# EAGLE design Reinhard (EAGLE 6.6.0)
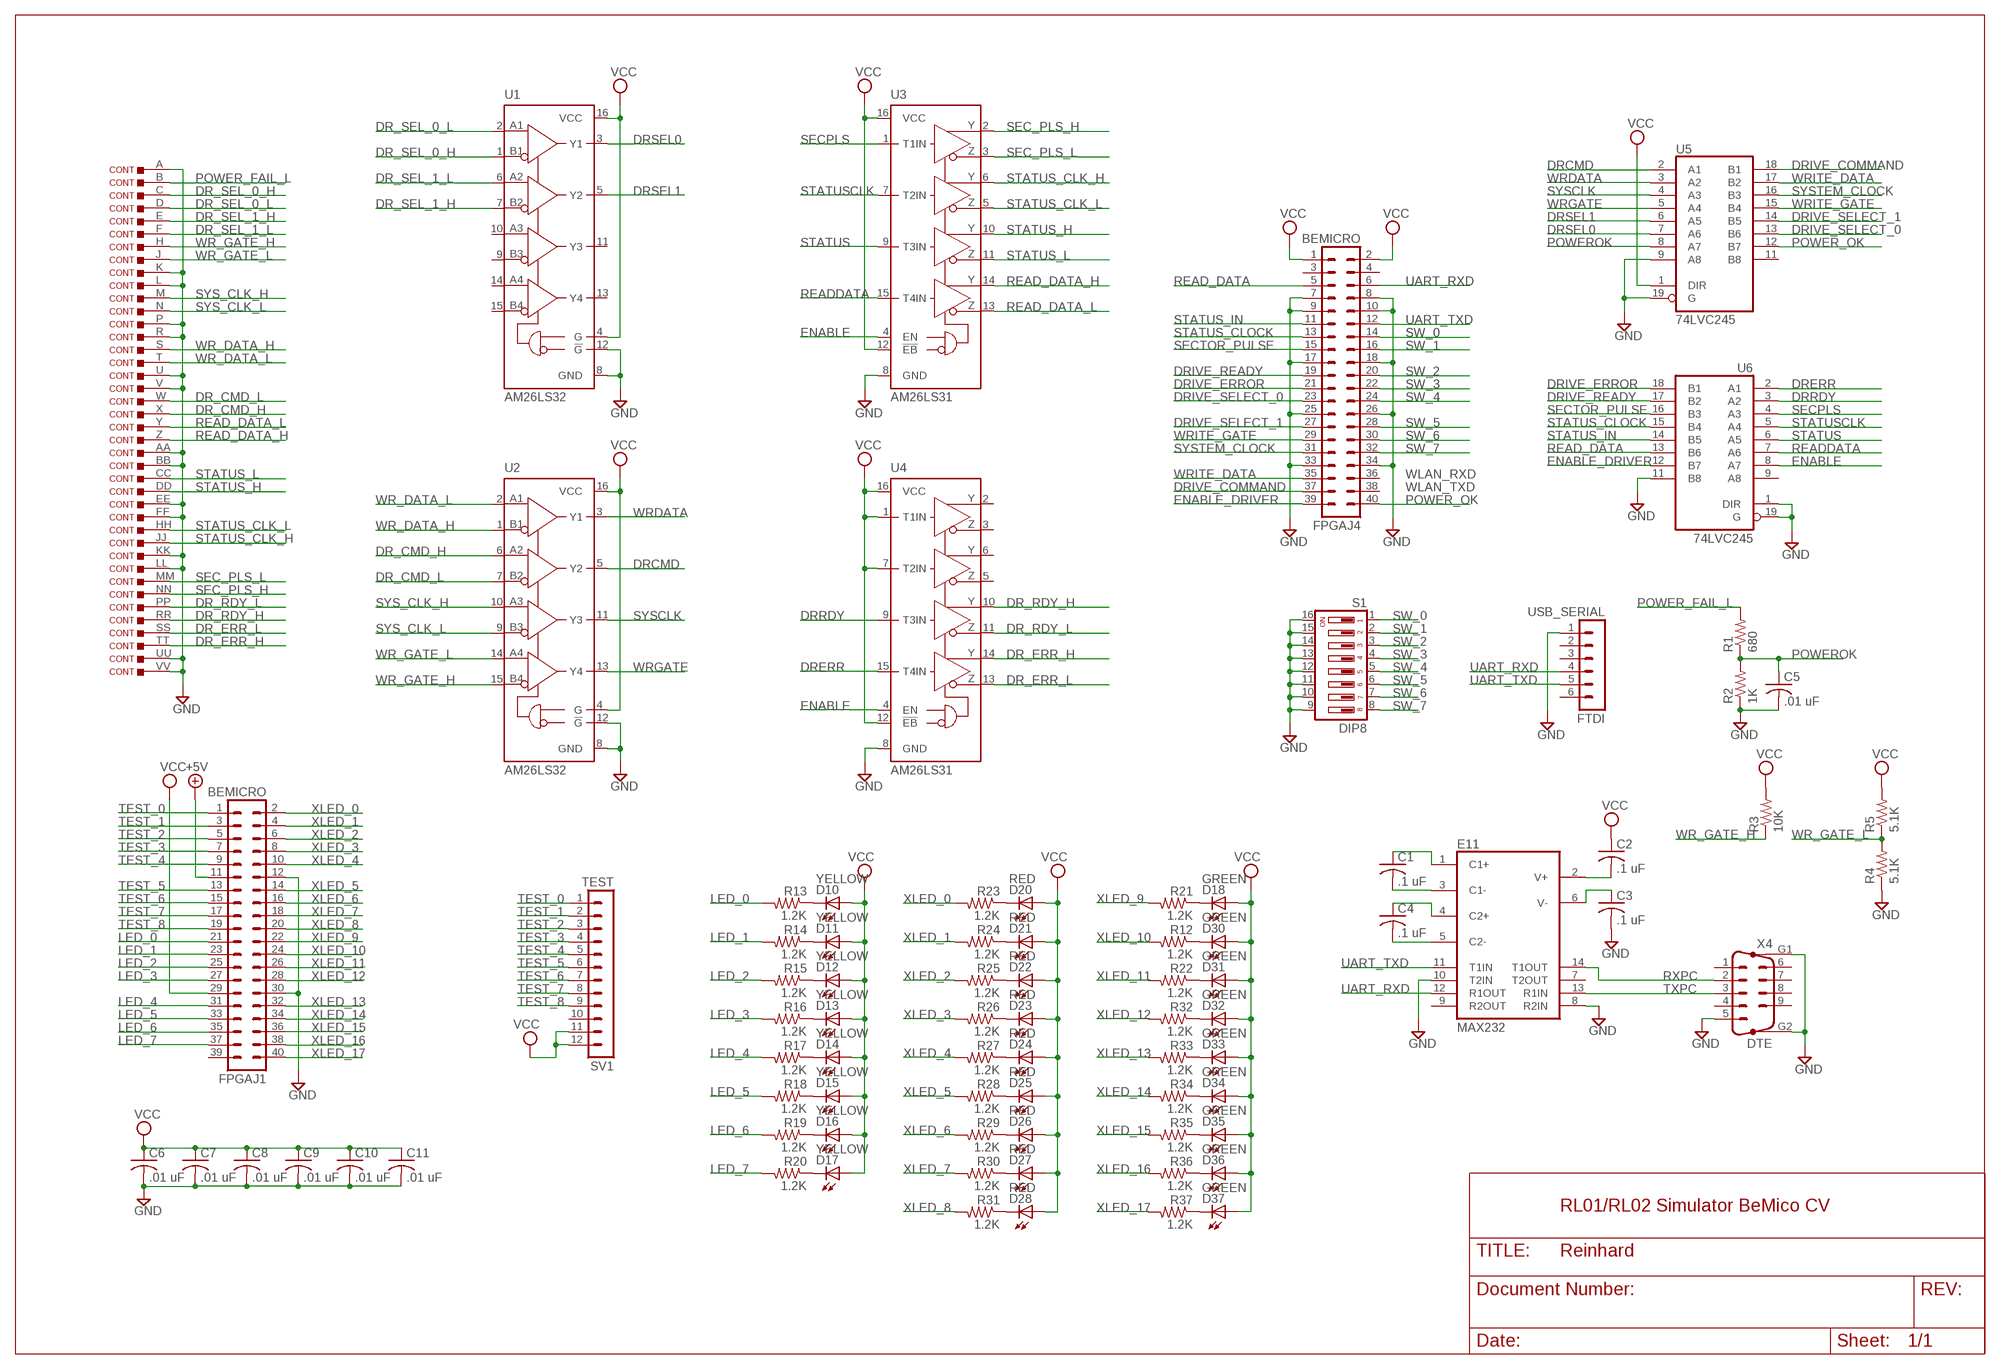
[diagram p0: schematic, sheet 1]

## Parts
C1  .1 uF  C-US050-025X075  [C050-025X075]
C2  .1 uF  C-US050-025X075  [C050-025X075]
C3  .1 uF  C-US050-025X075  [C050-025X075]
C4  .1 uF  C-US050-025X075  [C050-025X075]
C5  .01 uF  C-US050-025X075  [C050-025X075]
C6  .01 uF  C-US050-025X075  [C050-025X075]
C7  .01 uF  C-US050-025X075  [C050-025X075]
C8  .01 uF  C-US050-025X075  [C050-025X075]
C9  .01 uF  C-US050-025X075  [C050-025X075]
C10  .01 uF  C-US050-025X075  [C050-025X075]
C11  .01 uF  C-US050-025X075  [C050-025X075]
CONT  DEC40PINSV  [DEC40PINV]
D10  YELLOW  LED3MM  [LED3MM]
D11  YELLOW  LED3MM  [LED3MM]
D12  YELLOW  LED3MM  [LED3MM]
D13  YELLOW  LED3MM  [LED3MM]
D14  YELLOW  LED3MM  [LED3MM]
D15  YELLOW  LED3MM  [LED3MM]
D16  YELLOW  LED3MM  [LED3MM]
D17  YELLOW  LED3MM  [LED3MM]
D18  GREEN  LED3MM  [LED3MM]
D20  RED  LED3MM  [LED3MM]
D21  RED  LED3MM  [LED3MM]
D22  RED  LED3MM  [LED3MM]
D23  RED  LED3MM  [LED3MM]
D24  RED  LED3MM  [LED3MM]
D25  RED  LED3MM  [LED3MM]
D26  RED  LED3MM  [LED3MM]
D27  RED  LED3MM  [LED3MM]
D28  RED  LED3MM  [LED3MM]
D30  GREEN  LED3MM  [LED3MM]
D31  GREEN  LED3MM  [LED3MM]
D32  GREEN  LED3MM  [LED3MM]
D33  GREEN  LED3MM  [LED3MM]
D34  GREEN  LED3MM  [LED3MM]
D35  GREEN  LED3MM  [LED3MM]
D36  GREEN  LED3MM  [LED3MM]
D37  GREEN  LED3MM  [LED3MM]
E11  MAX232  [DIL16]
FPGAJ1  BEMICRO  MA20-2  [MA20-2]
FPGAJ4  BEMICRO  MA20-2  [MA20-2]
FTDI  USB_SERIAL  MA06-1  [MA06-1]
R1  680  R-US_0207/10  [0207/10]
R2  1K  R-US_0207/10  [0207/10]
R3  10K  R-US_0207/10  [0207/10]
R4  5.1K  R-US_0207/10  [0207/10]
R5  5.1K  R-US_0207/10  [0207/10]
R12  1.2K  R-US_0207/10  [0207/10]
R13  1.2K  R-US_0207/10  [0207/10]
R14  1.2K  R-US_0207/10  [0207/10]
R15  1.2K  R-US_0207/10  [0207/10]
R16  1.2K  R-US_0207/10  [0207/10]
R17  1.2K  R-US_0207/10  [0207/10]
R18  1.2K  R-US_0207/10  [0207/10]
R19  1.2K  R-US_0207/10  [0207/10]
R20  1.2K  R-US_0207/10  [0207/10]
R21  1.2K  R-US_0207/10  [0207/10]
R22  1.2K  R-US_0207/10  [0207/10]
R23  1.2K  R-US_0207/10  [0207/10]
R24  1.2K  R-US_0207/10  [0207/10]
R25  1.2K  R-US_0207/10  [0207/10]
R26  1.2K  R-US_0207/10  [0207/10]
R27  1.2K  R-US_0207/10  [0207/10]
R28  1.2K  R-US_0207/10  [0207/10]
R29  1.2K  R-US_0207/10  [0207/10]
R30  1.2K  R-US_0207/10  [0207/10]
R31  1.2K  R-US_0207/10  [0207/10]
R32  1.2K  R-US_0207/10  [0207/10]
R33  1.2K  R-US_0207/10  [0207/10]
R34  1.2K  R-US_0207/10  [0207/10]
R35  1.2K  R-US_0207/10  [0207/10]
R36  1.2K  R-US_0207/10  [0207/10]
R37  1.2K  R-US_0207/10  [0207/10]
S1  DIP8  DIP08YL  [DIP08YL]
SV1  TEST  MA12-1  [MA12-1]
U1  AM26LS32  MAX3095CPE  [DIL16]
U2  AM26LS32  MAX3095CPE  [DIL16]
U3  AM26LS31  MAX304  [DIL16]
U4  AM26LS31  MAX304  [DIL16]
U5  74LVC245  74LS245N  [DIL20]
U6  74LVC245  74LS245N  [DIL20]
X4  DTE  M09HP  [M09HP]

## Nets
+5V: FPGAJ1.11
DR_CMD_H: CONT.X U2.6(A2)
DR_CMD_L: CONT.W U2.7(B2)
DR_ERR_H: CONT.TT U4.14(Y4)
DR_ERR_L: CONT.SS U4.13(Z4)
DR_RDY_H: CONT.RR U4.10(Y3)
DR_RDY_L: CONT.PP U4.11(Z3)
DR_SEL_0_H: CONT.C U1.1(B1)
DR_SEL_0_L: CONT.D U1.2(A1)
DR_SEL_1_H: CONT.E U1.7(B2)
DR_SEL_1_L: CONT.F U1.6(A2)
DRCMD: U2.5(Y2) U5.2(A1)
DRERR: U4.15(T4IN) U6.2(A1)
DRIVE_COMMAND: FPGAJ4.37 U5.18(B1)
DRIVE_ERROR: FPGAJ4.21 U6.18(B1)
DRIVE_READY: FPGAJ4.19 U6.17(B2)
DRIVE_SELECT_0: FPGAJ4.23 U5.13(B6)
DRIVE_SELECT_1: FPGAJ4.27 U5.14(B5)
DRRDY: U4.9(T3IN) U6.3(A2)
DRSEL0: U1.3(Y1) U5.7(A6)
DRSEL1: U1.5(Y2) U5.6(A5)
ENABLE: U3.4(EN) U4.4(EN) U6.8(A7)
ENABLE_DRIVER: FPGAJ4.39 U6.12(B7)
GND: C3.2 C5.2 C6.2 C7.2 C8.2 C9.2 C10.2 C11.2 CONT.A CONT.AA CONT.BB CONT.EE CONT.FF CONT.K CONT.KK CONT.L CONT.LL CONT.P CONT.R CONT.U CONT.UU CONT.V CONT.VV E11.8(R2IN) E11.10(T2IN) FPGAJ1.12 FPGAJ1.30 FPGAJ4.7 FPGAJ4.8 FPGAJ4.9 FPGAJ4.10 FPGAJ4.17 FPGAJ4.18 FPGAJ4.25 FPGAJ4.26 FPGAJ4.33 FPGAJ4.34 FTDI.1 R2.1 R4.1 S1.9 S1.10 S1.11 S1.12 S1.13 S1.14 S1.15 S1.16 U1.8(GND) U1.12(!G) U2.8(GND) U2.12(!G) U3.8(GND) U4.8(GND) U5.9(A8) U5.19(G) U6.1(DIR) U6.11(B8) U6.19(G) X4.5 X4.G1 X4.G2
LED_0: FPGAJ1.21 R13.2
LED_1: FPGAJ1.23 R14.2
LED_2: FPGAJ1.25 R15.2
LED_3: FPGAJ1.27 R16.2
LED_4: FPGAJ1.31 R17.2
LED_5: FPGAJ1.33 R18.2
LED_6: FPGAJ1.35 R19.2
LED_7: FPGAJ1.37 R20.2
N$1: C1.2 E11.3(C1-)
N$2: C1.1 E11.1(C1+)
N$3: C4.1 E11.4(C2+)
N$4: C4.2 E11.5(C2-)
N$5: C3.1 E11.6(V-)
N$6: C2.2 E11.2(V+)
N$16: D30.K(C) R12.1
N$17: D31.K(C) R22.1
N$18: D32.K(C) R32.1
N$19: D33.K(C) R33.1
N$20: D34.K(C) R34.1
N$21: D35.K(C) R35.1
N$22: D36.K(C) R36.1
N$23: D37.K(C) R37.1
N$27: D10.K(C) R13.1
N$28: D11.K(C) R14.1
N$29: D12.K(C) R15.1
N$30: D13.K(C) R16.1
N$31: D14.K(C) R17.1
N$32: D15.K(C) R18.1
N$33: D16.K(C) R19.1
N$34: D17.K(C) R20.1
N$35: D18.K(C) R21.1
N$47: D20.K(C) R23.1
N$48: D21.K(C) R24.1
N$49: D22.K(C) R25.1
N$50: D23.K(C) R26.1
N$51: D24.K(C) R27.1
N$52: D25.K(C) R28.1
N$53: D26.K(C) R29.1
N$54: D27.K(C) R30.1
N$55: D28.K(C) R31.1
POWER_FAIL_L: CONT.B R1.2
POWER_OK: FPGAJ4.40 U5.12(B7)
POWEROK: C5.1 R1.1 R2.2 U5.8(A7)
READ_DATA: FPGAJ4.5 U6.13(B6)
READ_DATA_H: CONT.Z U3.14(Y4)
READ_DATA_L: CONT.Y U3.13(Z4)
READDATA: U3.15(T4IN) U6.7(A6)
RXPC: E11.14(T1OUT) X4.2
SEC_PLS_H: CONT.NN U3.2(Y1)
SEC_PLS_L: CONT.MM U3.3(Z1)
SECPLS: U3.1(T1IN) U6.4(A3)
SECTOR_PULSE: FPGAJ4.15 U6.16(B3)
STATUS: U3.9(T3IN) U6.6(A5)
STATUS_CLK_H: CONT.JJ U3.6(Y2)
STATUS_CLK_L: CONT.HH U3.5(Z2)
STATUS_CLOCK: FPGAJ4.13 U6.15(B4)
STATUS_H: CONT.DD U3.10(Y3)
STATUS_IN: FPGAJ4.11 U6.14(B5)
STATUS_L: CONT.CC U3.11(Z3)
STATUSCLK: U3.7(T2IN) U6.5(A4)
SW_0: FPGAJ4.14 S1.1
SW_1: FPGAJ4.16 S1.2
SW_2: FPGAJ4.20 S1.3
SW_3: FPGAJ4.22 S1.4
SW_4: FPGAJ4.24 S1.5
SW_5: FPGAJ4.28 S1.6
SW_6: FPGAJ4.30 S1.7
SW_7: FPGAJ4.32 S1.8
SYS_CLK_H: CONT.M U2.10(A3)
SYS_CLK_L: CONT.N U2.9(B3)
SYSCLK: U2.11(Y3) U5.4(A3)
SYSTEM_CLOCK: FPGAJ4.31 U5.16(B3)
TEST_0: FPGAJ1.1 SV1.1
TEST_1: FPGAJ1.3 SV1.2
TEST_2: FPGAJ1.5 SV1.3
TEST_3: FPGAJ1.7 SV1.4
TEST_4: FPGAJ1.9 SV1.5
TEST_5: FPGAJ1.13 SV1.6
TEST_6: FPGAJ1.15 SV1.7
TEST_7: FPGAJ1.17 SV1.8
TEST_8: FPGAJ1.19 SV1.9
TXPC: E11.13(R1IN) X4.3
UART_RXD: E11.12(R1OUT) FPGAJ4.6 FTDI.4
UART_TXD: E11.11(T1IN) FPGAJ4.12 FTDI.5
VCC: C2.1 C6.1 C7.1 C8.1 C9.1 C10.1 C11.1 D10.A D11.A D12.A D13.A D14.A D15.A D16.A D17.A D18.A D20.A D21.A D22.A D23.A D24.A D25.A D26.A D27.A D28.A D30.A D31.A D32.A D33.A D34.A D35.A D36.A D37.A FPGAJ1.29 FPGAJ4.1 FPGAJ4.2 R3.2 R5.2 SV1.11 SV1.12 U1.4(G) U1.16(VCC) U2.4(G) U2.16(VCC) U3.12(!EB) U3.16(VCC) U4.1(T1IN) U4.7(T2IN) U4.12(!EB) U4.16(VCC) U5.1(DIR)
WR_DATA_H: CONT.S U2.1(B1)
WR_DATA_L: CONT.T U2.2(A1)
WR_GATE_H: CONT.H R3.1 U2.15(B4)
WR_GATE_L: CONT.J R4.2 R5.1 U2.14(A4)
WRDATA: U2.3(Y1) U5.3(A2)
WRGATE: U2.13(Y4) U5.5(A4)
WRITE_DATA: FPGAJ4.35 U5.17(B2)
WRITE_GATE: FPGAJ4.29 U5.15(B4)
XLED_0: FPGAJ1.2 R23.2
XLED_1: FPGAJ1.4 R24.2
XLED_2: FPGAJ1.6 R25.2
XLED_3: FPGAJ1.8 R26.2
XLED_4: FPGAJ1.10 R27.2
XLED_5: FPGAJ1.14 R28.2
XLED_6: FPGAJ1.16 R29.2
XLED_7: FPGAJ1.18 R30.2
XLED_8: FPGAJ1.20 R31.2
XLED_9: FPGAJ1.22 R21.2
XLED_10: FPGAJ1.24 R12.2
XLED_11: FPGAJ1.26 R22.2
XLED_12: FPGAJ1.28 R32.2
XLED_13: FPGAJ1.32 R33.2
XLED_14: FPGAJ1.34 R34.2
XLED_15: FPGAJ1.36 R35.2
XLED_16: FPGAJ1.38 R36.2
XLED_17: FPGAJ1.40 R37.2
Unconnected: E11.7(T2OUT) E11.9(R2OUT) FPGAJ1.39 FPGAJ4.3 FPGAJ4.4 FPGAJ4.36 FPGAJ4.38 FTDI.2 FTDI.3 FTDI.6 SV1.10 U1.9(B3) U1.10(A3) U1.11(Y3) U1.13(Y4) U1.14(A4) U1.15(B4) U4.2(Y1) U4.3(Z1) U4.5(Z2) U4.6(Y2) U5.11(B8) U6.9(A8) X4.1 X4.4 X4.6 X4.7 X4.8 X4.9

## Notes on the sheet
- WLAN_RXD
- WLAN_TXD
- RL01/RL02 Simulator BeMico CV

## Power pins joined to a net without a drawn wire
GND: E11.15(GND) U5.10(GND) U6.10(GND)
VCC: E11.16(VCC) U5.20(VCC) U6.20(VCC)

## Library data of the parts
C1-C11 = rcl:C-US: CAPACITOR, American symbol
CONT = dec-con:DEC40PINS: 40 pin ribbon connector for BC08, BC11 cables.
D10-D18 D20-D28 D30-D37 = led:LED: LED OSRAM: - CHIPLED LG R971, LG N971, LY N971, LG Q971, LY Q971, LO R971, LY R971 LH N974, LH R974 LS Q976, LO Q976, LY Q976 LO Q996 - Hyper CHIPLED LW Q18S LB Q993, LB Q99A, LB R99A - SideLED LS A670, LO A670, LY A670, LG A670, LP A670 LB A673, LV A673, LT A673, LW A673 LH A674 LY A675 LS A676, LA A676, LO A676, LY A676, LW A676 LS A679, LY A679, LG A679 - Hyper Micro SIDELED® LS Y876, LA Y876, LO Y876, LY Y876 LT Y87S - SmartLED LW L88C, LW L88S LB L89C, LB L89S, LG L890 LS L89K, LO L89K, LY L89K LS L896, LA L896, LO L896, LY L896 - TOPLED LS T670, LO T670, LY T670, LG T670, LP T670 LSG T670, LSP T670, LSY T670, LOP T670, LYG T670 LG T671, LOG T671, LSG T671 LB T673, LV T673, LT T673, LW T673 LH T674 LS T676, LA T676, LO T676, LY T676, LB T676, LH T676, LSB T676, LW T676 LB T67C, LV T67C, LT T67C, LS T67K, LO T67K, LY T67K, LW E67C LS E67B, LA E67B, LO E67B, LY E67B, LB E67C, LV E67C, LT E67C LW T67C LS T679, LY T679, LG T679 LS T770, LO T770, LY T770, LG T770, LP T770 LB T773, LV T773, LT T773, LW T773 LH T774 LS E675, LA E675, LY E675, LS T675 LS T776, LA T776, LO T776, LY T776, LB T776 LHGB T686 LT T68C, LB T68C - Hyper Mini TOPLED® LB M676 - Mini TOPLED Santana® LG M470 LS M47K, LO M47K, LY M47K Source: http://www.osram.convergy.de LUXEON: - LUMILED® LXK2-PW12-R00, LXK2-PW12-S00, LXK2-PW14-U00, LXK2-PW14-V00 LXK2-PM12-R00, LXK2-PM12-S00, LXK2-PM14-U00 LXK2-PE12-Q00, LXK2-PE12-R00, LXK2-PE12-S00, LXK2-PE14-T00, LXK2-PE14-U00 LXK2-PB12-K00, LXK2-PB12-L00, LXK2-PB12-M00, LXK2-PB14-N00, LXK2-PB14-P00, LXK2-PB14-Q00 LXK2-PR12-L00, LXK2-PR12-M00, LXK2-PR14-Q00, LXK2-PR14-R00 LXK2-PD12-Q00, LXK2-PD12-R00, LXK2-PD12-S00 LXK2-PH12-R00, LXK2-PH12-S00 LXK2-PL12-P00, LXK2-PL12-Q00, LXK2-PL12-R00 Source: www.luxeon.com KINGBRIGHT: KA-3528ASYC Source: www.kingbright.com
E11 = maxim:MAX232: RS232 TRANSCEIVER; MF: MAXIM; MPN: MAX232ACPE+; OC_FARNELL: 9723773; OC_NEWARK: 68K4544
FPGAJ1 FPGAJ4 = con-lstb:MA20-2: PIN HEADER; OC_FARNELL: unknown; OC_NEWARK: unknown
FTDI = con-lstb:MA06-1: PIN HEADER; OC_FARNELL: unknown; OC_NEWARK: unknown
R1-R5 R12-R37 = rcl:R-US_: RESISTOR, American symbol
S1 = switch-dil:DIP08YL: DIL/CODE SWITCH; OC_FARNELL: unknown; OC_NEWARK: unknown
SV1 = con-lstb:MA12-1: PIN HEADER; OC_FARNELL: unknown; OC_NEWARK: unknown
U1 U2 = maxim:MAX309*: ±15kV ESD-Protected, 10Mbps, 3V/5V, Quad RS-422/RS-485 Receivers Source: http://pdfserv.maxim-ic.com/en/ds/MAX3095-MAX3096.pdf; MF: MAXIM; MPN: MAX3095CPE+; OC_FARNELL: 9723919; OC_NEWARK: 67K4750
U3 U4 = maxim:MAX304*: ±10kV ESD-Protected, Quad 5V RS-485/422 Transmitters Source: MAX3040-MAX3045.pdf
U5 U6 = 74xx-us:74*245: Octal BUS TRANSCEIVER, 3-state
X4 = con-subd:M09HP: SUB-D; OC_FARNELL: unknown; OC_NEWARK: unknown

## Board
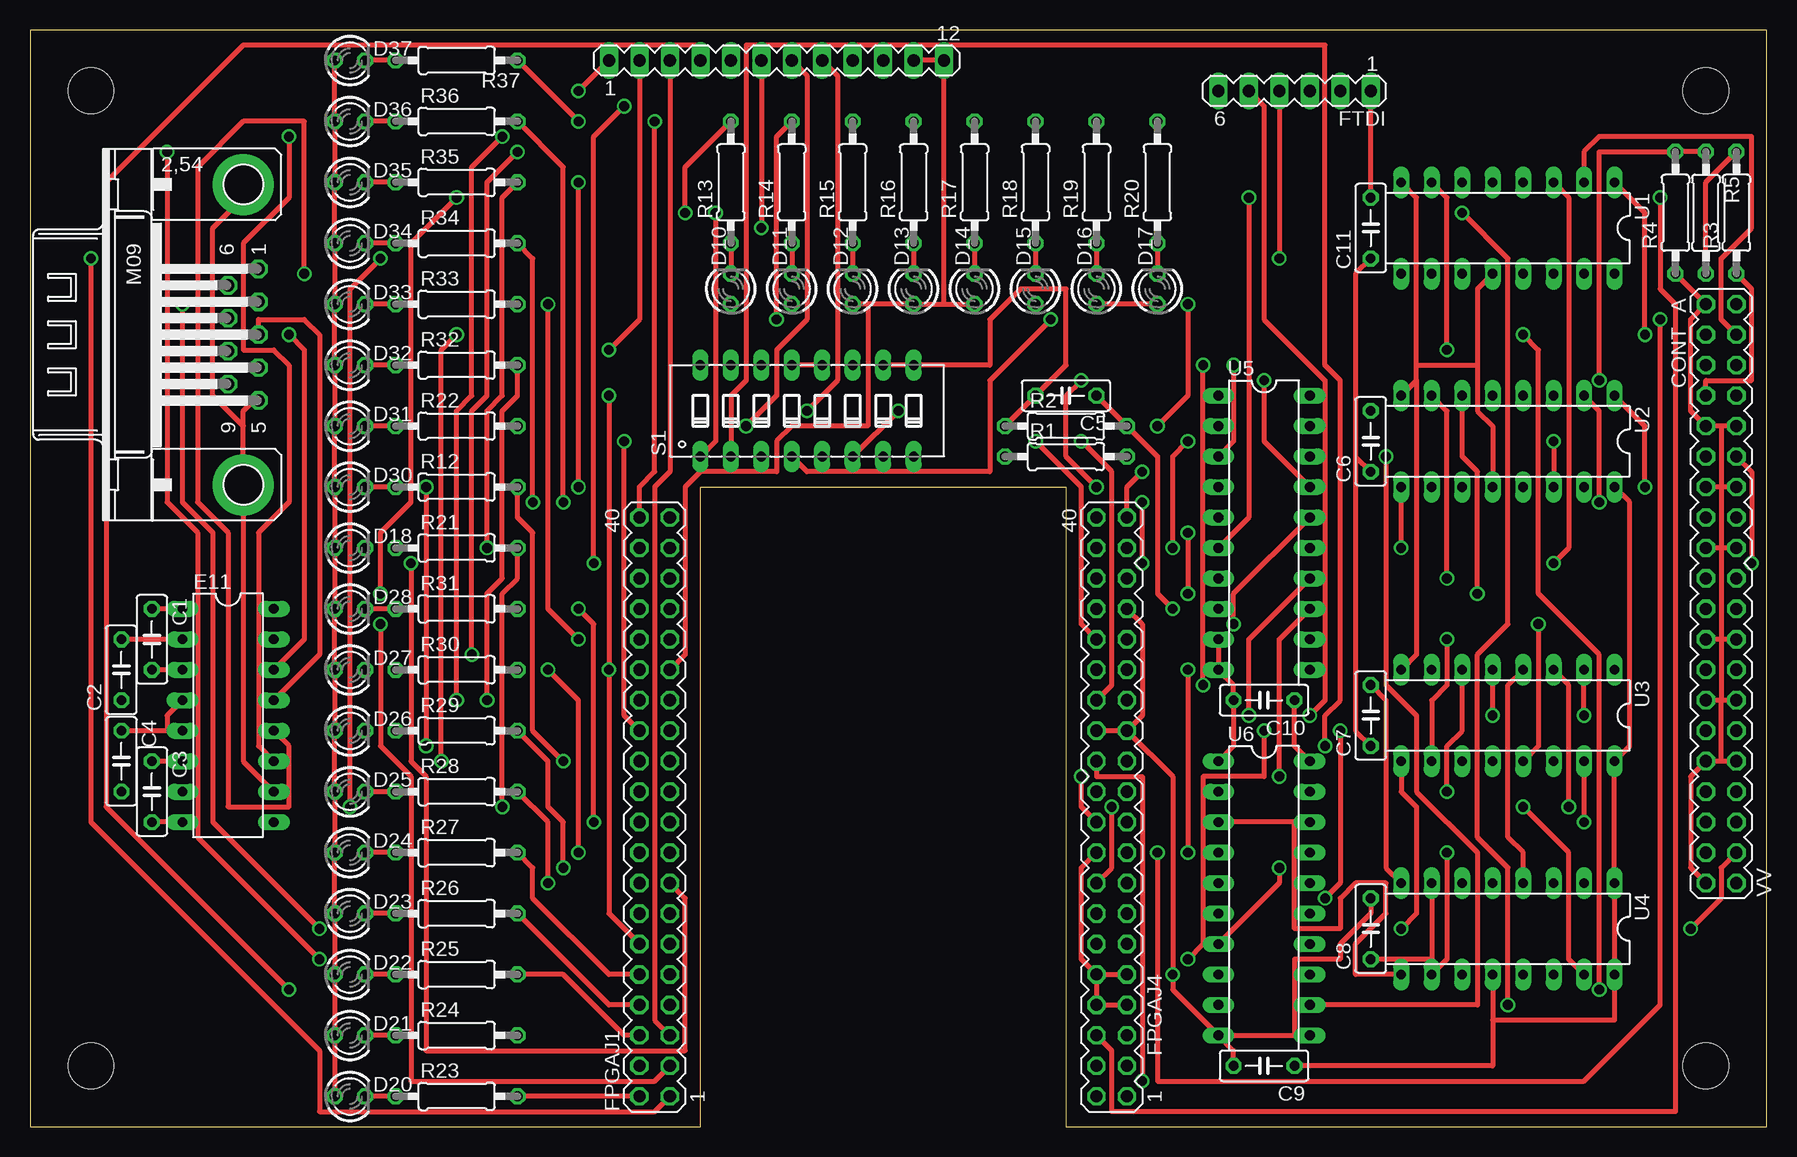
[diagram p1: board, top side]
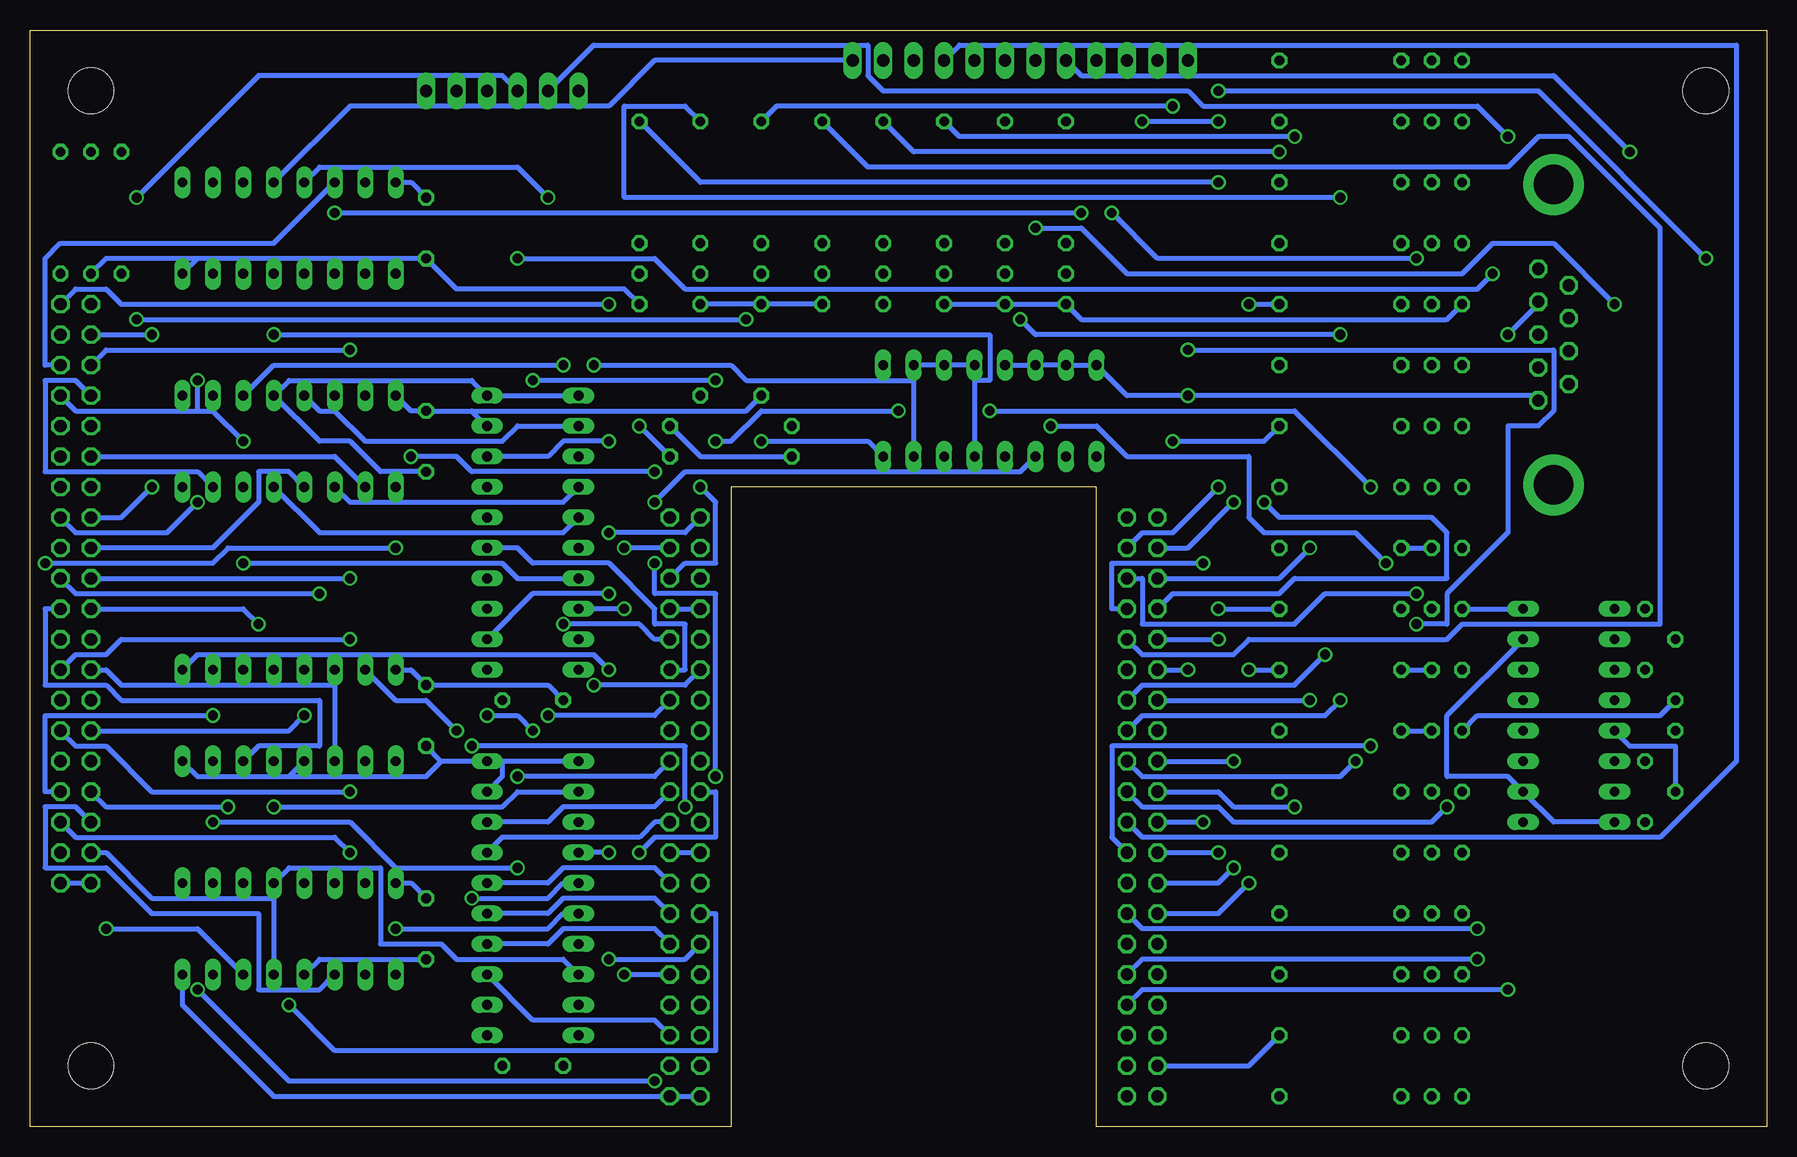
[diagram p2: board, bottom side, seen from below]

Size 144.78 x 91.44 mm. Coordinates in mm from the lower left corner, seen from the top.
Outline: 0,0 55.88,0 55.88,53.34 86.36,53.34 86.36,0 144.78,0 144.78,91.44 0,91.44 0,0
Copper layers (1+16): Top 0.035mm / dielectric 1.5mm / Bottom 0.035mm
Design rules "16mils": minimum track width 16mil, minimum drill 32mil, track to track 15mil, track to pad 10mil, pad to pad 10mil, via to via 10mil, smd to smd 10mil, copper to edge 13mil, drill to drill 10mil, minimum pad ring 10mil, minimum via ring 8mil, stop-mask expansion 0mil, vias tented up to drill 0mil, thermal gap 10mil
Holes 3.81 mm at 5.08,86.36 139.7,86.36 5.08,5.08 139.7,5.08

### Footprints (pad centres in the part's own frame; a part is rotated, then mirrored left to right if it is on the bottom)
C050-025X075 = drill 0.813 octagon: 1 -2.54,0; 2 2.54,0
DEC40PINV = drill 1.016 octagon: A -24.13,-1.27; AA 3.81,-1.27; B -24.13,1.27; BB 3.81,1.27; C -21.59,-1.27; CC 6.35,-1.27; D -21.59,1.27; DD 6.35,1.27; E -19.05,-1.27; EE 8.89,-1.27; F -19.05,1.27; FF 8.89,1.27; H -16.51,-1.27; HH 11.43,-1.27; J -16.51,1.27; JJ 11.43,1.27; K -13.97,-1.27; KK 13.97,-1.27; L -13.97,1.27; LL 13.97,1.27; M -11.43,-1.27; MM 16.51,-1.27; N -11.43,1.27; NN 16.51,1.27; P -8.89,-1.27; PP 19.05,-1.27; R -8.89,1.27; RR 19.05,1.27; S -6.35,-1.27; SS 21.59,-1.27; T -6.35,1.27; TT 21.59,1.27; U -3.81,-1.27; UU 24.13,-1.27; V -3.81,1.27; VV 24.13,1.27; W -1.27,-1.27; X -1.27,1.27; Y 1.27,-1.27; Z 1.27,1.27
LED3MM = drill 0.813 octagon: A -1.27,0; K 1.27,0
DIL16 = drill 0.813 long: 1 -8.89,-3.81; 2 -6.35,-3.81; 3 -3.81,-3.81; 4 -1.27,-3.81; 5 1.27,-3.81; 6 3.81,-3.81; 7 6.35,-3.81; 8 8.89,-3.81; 9 8.89,3.81; 10 6.35,3.81; 11 3.81,3.81; 12 1.27,3.81; 13 -1.27,3.81; 14 -3.81,3.81; 15 -6.35,3.81; 16 -8.89,3.81
MA20-2 = drill 1.016 octagon: 1 -24.13,-1.27; 2 -24.13,1.27; 3 -21.59,-1.27; 4 -21.59,1.27; 5 -19.05,-1.27; 6 -19.05,1.27; 7 -16.51,-1.27; 8 -16.51,1.27; 9 -13.97,-1.27; 10 -13.97,1.27; 11 -11.43,-1.27; 12 -11.43,1.27; 13 -8.89,-1.27; 14 -8.89,1.27; 15 -6.35,-1.27; 16 -6.35,1.27; 17 -3.81,-1.27; 18 -3.81,1.27; 19 -1.27,-1.27; 20 -1.27,1.27; 21 1.27,-1.27; 22 1.27,1.27; 23 3.81,-1.27; 24 3.81,1.27; 25 6.35,-1.27; 26 6.35,1.27; 27 8.89,-1.27; 28 8.89,1.27; 29 11.43,-1.27; 30 11.43,1.27; 31 13.97,-1.27; 32 13.97,1.27; 33 16.51,-1.27; 34 16.51,1.27; 35 19.05,-1.27; 36 19.05,1.27; 37 21.59,-1.27; 38 21.59,1.27; 39 24.13,-1.27; 40 24.13,1.27
MA06-1 = drill 1.016 long: 1 -6.35,0; 2 -3.81,0; 3 -1.27,0; 4 1.27,0; 5 3.81,0; 6 6.35,0
0207/10 = drill 0.813 octagon: 1 -5.08,0; 2 5.08,0
DIP08YL = drill 0.813 long: 1 -8.89,-3.81; 2 -6.35,-3.81; 3 -3.81,-3.81; 4 -1.27,-3.81; 5 1.27,-3.81; 6 3.81,-3.81; 7 6.35,-3.81; 8 8.89,-3.81; 9 8.89,3.81; 10 6.35,3.81; 11 3.81,3.81; 12 1.27,3.81; 13 -1.27,3.81; 14 -3.81,3.81; 15 -6.35,3.81; 16 -8.89,3.81
MA12-1 = drill 1.016 long: 1 -13.97,0; 2 -11.43,0; 3 -8.89,0; 4 -6.35,0; 5 -3.81,0; 6 -1.27,0; 7 1.27,0; 8 3.81,0; 9 6.35,0; 10 8.89,0; 11 11.43,0; 12 13.97,0
DIL20 = drill 0.813 long: 1 -11.43,-3.81; 2 -8.89,-3.81; 3 -6.35,-3.81; 4 -3.81,-3.81; 5 -1.27,-3.81; 6 1.27,-3.81; 7 3.81,-3.81; 8 6.35,-3.81; 9 8.89,-3.81; 10 11.43,-3.81; 11 11.43,3.81; 12 8.89,3.81; 13 6.35,3.81; 14 3.81,3.81; 15 1.27,3.81; 16 -1.27,3.81; 17 -3.81,3.81; 18 -6.35,3.81; 19 -8.89,3.81; 20 -11.43,3.81
M09HP = drill 1.016 octagon: 1 -5.486,1.27; 2 -2.743,1.27; 3 0,1.27; 4 2.743,1.27; 5 5.486,1.27; 6 -4.115,-1.27; 7 -1.372,-1.27; 8 1.372,-1.27; 9 4.115,-1.27 | drill 3.302 pad 5.08: G1 -12.522,0; G2 12.522,0

### Placement (x,y rotation side)
C1  10.16,40.64 270 top
C2  7.62,38.1 90 top
C3  10.16,27.94 270 top
C4  7.62,30.48 270 top
C5  86.36,60.96 180 top
C6  111.76,57.15 90 top
C7  111.76,34.29 90 top
C8  111.76,16.51 90 top
C9  102.87,5.08 180 top
C10  102.87,35.56 180 top
C11  111.76,74.93 90 top
CONT  140.97,44.45 270 top
D10  58.42,69.85 90 top
D11  63.5,69.85 90 top
D12  68.58,69.85 90 top
D13  73.66,69.85 90 top
D14  78.74,69.85 90 top
D15  83.82,69.85 90 top
D16  88.9,69.85 90 top
D17  93.98,69.85 90 top
D18  26.67,48.26 0 top
D20  26.67,2.54 0 top
D21  26.67,7.62 0 top
D22  26.67,12.7 0 top
D23  26.67,17.78 0 top
D24  26.67,22.86 0 top
D25  26.67,27.94 0 top
D26  26.67,33.02 0 top
D27  26.67,38.1 0 top
D28  26.67,43.18 0 top
D30  26.67,53.34 0 top
D31  26.67,58.42 0 top
D32  26.67,63.5 0 top
D33  26.67,68.58 0 top
D34  26.67,73.66 0 top
D35  26.67,78.74 0 top
D36  26.67,83.82 0 top
D37  26.67,88.9 0 top
E11  16.51,34.29 270 top
FPGAJ1  52.07,26.67 90 top
FPGAJ4  90.17,26.67 90 top
FTDI  105.41,86.36 180 top
R1  86.36,55.88 0 top
R2  86.36,58.42 0 top
R3  142.24,76.2 90 top
R4  137.16,76.2 90 top
R5  139.7,76.2 270 top
R12  35.56,53.34 0 top
R13  58.42,78.74 90 top
R14  63.5,78.74 90 top
R15  68.58,78.74 90 top
R16  73.66,78.74 90 top
R17  78.74,78.74 90 top
R18  83.82,78.74 90 top
R19  88.9,78.74 90 top
R20  93.98,78.74 90 top
R21  35.56,48.26 0 top
R22  35.56,58.42 0 top
R23  35.56,2.54 0 top
R24  35.56,7.62 0 top
R25  35.56,12.7 0 top
R26  35.56,17.78 0 top
R27  35.56,22.86 0 top
R28  35.56,27.94 0 top
R29  35.56,33.02 0 top
R30  35.56,38.1 0 top
R31  35.56,43.18 0 top
R32  35.56,63.5 0 top
R33  35.56,68.58 0 top
R34  35.56,73.66 0 top
R35  35.56,78.74 0 top
R36  35.56,83.82 0 top
R37  35.56,88.9 0 top
S1  64.77,59.69 0 top
SV1  62.23,88.9 0 top
U1  123.19,74.93 180 top
U2  123.19,57.15 180 top
U3  123.19,34.29 180 top
U4  123.19,16.51 180 top
U5  102.87,49.53 270 top
U6  102.87,19.05 270 top
X4  17.78,66.04 270 top

### Tracks (layer width: path | path; a pad name or v marks a point on that pad's centre or on a via)
DR_CMD_H  (via drill 0.81)
  Top 0.406: U2.6 119.38,55.88 120.65,54.61 v120.65,44.45
  Bottom 0.406: v120.65,44.45 140.97,44.45 CONT.X
DR_CMD_L  (via drill 0.81)
  Top 0.406: U2.7 118.11,59.69 v118.11,45.72
  Bottom 0.406: CONT.W v118.11,45.72
DR_ERR_H  (via drill 0.81)
  Top 0.406: v138.43,16.51 140.97,19.05 140.97,21.59 CONT.TT
  Bottom 0.406: U4.14 130.81,16.51 v138.43,16.51
DR_ERR_L
  Bottom 0.406: U4.13 124.46,19.05 134.62,19.05 138.43,22.86 CONT.SS
DR_RDY_H  (via drill 0.81)
  Top 0.406: U4.10 118.11,13.97 v118.11,22.86
  Bottom 0.406: v118.11,22.86 119.38,24.13 140.97,24.13 CONT.RR
DR_RDY_L
  Bottom 0.406: U4.11 120.65,11.43 125.73,11.43 125.73,17.78 134.62,17.78 138.43,21.59 143.51,21.59 143.51,26.67 140.97,26.67 CONT.PP
DR_SEL_0_H  (via drill 0.81)
  Top 0.406: U1.1 134.62,76.2 v134.62,66.04
  Bottom 0.406: CONT.C v134.62,66.04
DR_SEL_0_L
  Top 0.406: U1.2 129.54,81.28 130.81,82.55 143.51,82.55 143.51,74.93 140.97,72.39 140.97,67.31 CONT.D
DR_SEL_1_H  (via drill 0.81)
  Top 0.406: U1.7 118.11,77.47 v118.11,64.77
  Bottom 0.406: v118.11,64.77 138.43,64.77 CONT.E
DR_SEL_1_L
  Bottom 0.406: U1.6 124.46,73.66 142.24,73.66 143.51,72.39 143.51,63.5 CONT.F
DRCMD
  Bottom 0.406: U5.2 104.14,58.42 105.41,57.15 116.84,57.15 119.38,59.69 120.65,59.69 U2.5
DRERR  (via drill 0.81)
  Top 0.406: v124.46,26.67 128.27,22.86 128.27,13.97 U4.15
  Bottom 0.406: U6.2 104.14,27.94 105.41,26.67 v124.46,26.67
DRIVE_COMMAND  (via drill 0.81)
  Top 0.406: v96.52,57.15 95.25,55.88 v95.25,48.26
  Bottom 0.406: U5.18 101.6,55.88 100.33,57.15 v96.52,57.15 | FPGAJ4.37 v95.25,48.26
DRIVE_ERROR
  Bottom 0.406: U6.18 101.6,25.4 100.33,26.67 92.71,26.67 FPGAJ4.21
DRIVE_READY
  Bottom 0.406: U6.17 105.41,24.13 93.98,24.13 92.71,25.4 FPGAJ4.19
DRIVE_SELECT_0  (via drill 0.81)
  Top 0.406: U5.13 104.14,40.64 v104.14,29.21
  Bottom 0.406: v104.14,29.21 92.71,29.21 FPGAJ4.23
DRIVE_SELECT_1  (via drill 0.81)
  Top 0.406: U5.14 101.6,40.64 v101.6,34.29
  Bottom 0.406: v101.6,34.29 92.71,34.29 FPGAJ4.27
DRRDY
  Top 0.406: U6.3 105.41,25.4 105.41,16.51 109.22,16.51 109.22,19.05 110.49,20.32 113.03,20.32 113.03,17.78 110.49,15.24 110.49,12.7 U4.9
DRSEL0  (via drill 0.81)
  Top 0.406: v127,46.99 128.27,48.26 128.27,77.47 U1.3
  Bottom 0.406: U5.7 104.14,45.72 105.41,46.99 v127,46.99
DRSEL1  (via drill 0.81)
  Top 0.406: U5.6 101.6,50.8 v101.6,77.47
  Bottom 0.406: v101.6,77.47 104.14,80.01 120.65,80.01 U1.5
ENABLE
  Top 0.406: U3.4 123.19,36.83 123.19,24.13 124.46,22.86 U4.4
  Bottom 0.406: U6.8 100.33,13.97 109.22,13.97 110.49,15.24 115.57,15.24 115.57,21.59 123.19,21.59 U4.4
ENABLE_DRIVER  (via drill 0.81)
  Top 0.406: U6.12 120.65,10.16 120.65,22.86 115.57,27.94 115.57,34.29 113.03,36.83 v113.03,55.88 | v92.71,54.61 91.44,53.34 FPGAJ4.39
  Bottom 0.406: v113.03,55.88 109.22,55.88 107.95,54.61 v92.71,54.61
GND  (via drill 0.81)
  Top 0.406: E11.8 C3.2 | FPGAJ1.12 48.26,17.78 v48.26,38.1 v48.26,60.96 | S1.10 S1.9 80.01,63.5 80.01,67.31 82.55,69.85 86.36,69.85 86.36,63.5 C5.2 R2.1 | S1.12 S1.13 | 17.78,58.42 X4.G2 17.78,30.48 E11.10 | 17.78,58.42 17.78,59.69 19.05,60.96 X4.5 | 17.78,58.42 15.24,60.96 15.24,74.93 17.78,77.47 X4.G1 | FPGAJ4.10 FPGAJ4.8 FPGAJ4.7 | FPGAJ4.10 FPGAJ4.9 | FPGAJ4.18 87.63,21.59 87.63,13.97 FPGAJ4.10 | U6.10 100.33,6.35 C9.2 | U6.10 105.41,7.62 | 105.41,7.62 U6.11 | FPGAJ4.25 FPGAJ4.26 | FPGAJ4.25 92.71,34.29 92.71,41.91 FPGAJ4.33 | U6.10 95.25,11.43 v95.25,12.7 95.25,29.21 FPGAJ4.25 | CONT.FF 140.97,35.56 | 140.97,35.56 CONT.EE | CONT.BB 140.97,40.64 | 140.97,40.64 CONT.AA | 140.97,40.64 140.97,35.56 | CONT.LL 140.97,30.48 | 140.97,30.48 CONT.KK 138.43,29.21 138.43,21.59 CONT.UU | 140.97,30.48 140.97,35.56 | CONT.V 140.97,48.26 | 140.97,48.26 CONT.U | CONT.R 140.97,53.34 | 140.97,53.34 CONT.P | 140.97,53.34 140.97,48.26 | CONT.L 140.97,58.42 | 140.97,58.42 CONT.K 138.43,59.69 138.43,67.31 CONT.A R4.1 | 140.97,58.42 140.97,53.34 | 140.97,48.26 140.97,40.64 | U5.9 U5.10 100.33,36.83 C10.2 100.33,31.75 U6.1 | U4.8 113.03,21.59 113.03,35.56 C7.2 | U2.12 121.92,58.42 120.65,59.69 120.65,63.5 | 120.65,63.5 120.65,69.85 U1.12 | C11.2 FTDI.1 | U1.8 115.57,77.47 115.57,63.5 | 115.57,62.23 115.57,63.5 | U2.8 115.57,62.23 | 115.57,63.5 120.65,63.5 | U3.8 115.57,39.37 115.57,62.23 | 105.41,7.62 105.41,13.97 109.22,13.97 109.22,15.24 111.76,17.78 C8.2
  Bottom 0.406: E11.8 17.78,25.4 E11.10 21.59,29.21 26.67,29.21 26.67,34.29 E11.15 | FPGAJ1.30 v48.26,38.1 | S1.12 S1.11 S1.10 | S1.13 S1.14 S1.15 S1.16 53.34,60.96 v48.26,60.96 19.05,60.96 X4.5 | FPGAJ4.17 FPGAJ4.18 | FPGAJ4.33 FPGAJ4.34 | v95.25,12.7 FPGAJ4.9 | CONT.VV CONT.UU | U6.19 105.41,29.21 105.41,30.48 U6.1 | C8.2 113.03,20.32 U4.8 | U3.8 113.03,38.1 C7.2 101.6,36.83 C10.2 | C11.2 113.03,78.74 U1.8 | 107.95,59.69 U5.19 | 107.95,59.69 C6.2 113.03,59.69 U2.8 | C5.2 85.09,59.69 107.95,59.69 | CONT.U 129.54,48.26 125.73,52.07 125.73,54.61 123.19,54.61 U2.12
LED_0  (via drill 0.81)
  Top 0.406: R13.2 54.61,80.01 v54.61,76.2 | v29.21,72.39 26.67,69.85 v26.67,26.67
  Bottom 0.406: v54.61,76.2 50.8,72.39 v29.21,72.39 | v26.67,26.67 27.94,25.4 44.45,25.4 45.72,26.67 52.07,26.67 FPGAJ1.21
LED_1  (via drill 0.81)
  Top 0.406: R14.2 62.23,82.55 v62.23,67.31 | v35.56,66.04 34.29,64.77 v34.29,30.48
  Bottom 0.406: v62.23,67.31 60.96,66.04 v35.56,66.04 | v34.29,30.48 35.56,29.21 52.07,29.21 FPGAJ1.23
LED_2  (via drill 0.81)
  Top 0.406: v39.37,82.55 36.83,80.01 36.83,60.96 35.56,59.69 v35.56,35.56
  Bottom 0.406: R15.2 67.31,82.55 v39.37,82.55 | v35.56,35.56 36.83,34.29 52.07,34.29 FPGAJ1.25
LED_3  (via drill 0.81)
  Top 0.406: v40.64,81.28 38.1,78.74 38.1,60.96 36.83,59.69 v36.83,39.37
  Bottom 0.406: R16.2 71.12,81.28 v40.64,81.28 | v36.83,39.37 39.37,36.83 52.07,36.83 FPGAJ1.27
LED_4
  Bottom 0.406: R17.2 74.93,80.01 21.59,80.01 19.05,82.55 16.51,82.55 8.89,74.93 8.89,41.91 25.4,41.91 26.67,40.64 43.18,40.64 44.45,39.37 52.07,39.37 FPGAJ1.31
LED_5  (via drill 0.81)
  Top 0.406: v49.53,85.09 46.99,82.55 v46.99,46.99
  Bottom 0.406: R18.2 82.55,85.09 v49.53,85.09 | v46.99,46.99 54.61,46.99 54.61,43.18 FPGAJ1.33
LED_6  (via drill 0.81)
  Top 0.406: v35.56,77.47 31.75,73.66 31.75,52.07 29.21,49.53 v29.21,44.45
  Bottom 0.406: R19.2 90.17,85.09 95.25,85.09 95.25,77.47 v35.56,77.47 | v29.21,44.45 36.83,44.45 39.37,41.91 52.07,41.91 52.07,45.72 FPGAJ1.35
LED_7  (via drill 0.81)
  Top 0.406: v45.72,53.34 v45.72,78.74
  Bottom 0.406: R20.2 88.9,78.74 v45.72,78.74 | v45.72,53.34 49.53,49.53 52.07,49.53 FPGAJ1.37
N$1
  Top 0.406: E11.3 C1.2
N$2
  Top 0.406: E11.1 C1.1
N$3
  Top 0.406: C4.1 11.43,33.02 11.43,34.29 E11.4
N$4
  Bottom 0.406: C4.2 7.62,31.75 11.43,31.75 E11.5
N$5
  Top 0.406: E11.6 C3.1
N$6
  Top 0.406: E11.2 C2.2
N$16
  Top 0.406: R12.1 D30.K
N$17
  Top 0.406: R22.1 D31.K
N$18
  Top 0.406: R32.1 D32.K
N$19
  Top 0.406: R33.1 D33.K
N$20
  Top 0.406: R34.1 D34.K
N$21
  Top 0.406: R35.1 D35.K
N$22
  Top 0.406: R36.1 D36.K
N$23
  Top 0.406: R37.1 D37.K
N$27
  Top 0.406: R13.1 D10.K
N$28
  Top 0.406: R14.1 D11.K
N$29
  Top 0.406: R15.1 D12.K
N$30
  Top 0.406: R16.1 D13.K
N$31
  Top 0.406: R17.1 D14.K
N$32
  Top 0.406: R18.1 D15.K
N$33
  Top 0.406: R19.1 D16.K
N$34
  Top 0.406: R20.1 D17.K
N$35
  Bottom 0.406: R21.1 D18.K
N$47
  Top 0.406: R23.1 D20.K
N$48
  Top 0.406: R24.1 D21.K
N$49
  Top 0.406: R25.1 D22.K
N$50
  Top 0.406: R26.1 D23.K
N$51
  Top 0.406: R27.1 D24.K
N$52
  Top 0.406: R28.1 D25.K
N$53
  Bottom 0.406: R29.1 D26.K
N$54
  Bottom 0.406: R30.1 D27.K
N$55
  Top 0.406: R31.1 D28.K
POWER_FAIL_L  (via drill 0.81)
  Top 0.406: v93.98,58.42 96.52,60.96 v96.52,68.58
  Bottom 0.406: v93.98,58.42 R1.2 | v96.52,68.58 137.16,68.58 138.43,69.85 140.97,69.85 CONT.B
POWER_OK  (via drill 0.81)
  Top 0.406: v96.52,49.53 v96.52,44.45
  Bottom 0.406: U5.12 102.87,44.45 v96.52,44.45 | v96.52,49.53 90.17,49.53 FPGAJ4.40
POWEROK  (via drill 0.81)
  Top 0.406: v95.25,43.18 93.98,44.45 93.98,55.88 R2.2 C5.1
  Bottom 0.406: R1.1 88.9,55.88 R2.2 | v95.25,43.18 U5.8
READ_DATA
  Bottom 0.406: U6.13 102.87,8.89 92.71,8.89 FPGAJ4.5
READ_DATA_H
  Bottom 0.406: U3.14 125.73,31.75 120.65,31.75 120.65,35.56 137.16,35.56 138.43,36.83 143.51,36.83 143.51,43.18 CONT.Z
READ_DATA_L  (via drill 0.81)
  Top 0.406: U3.13 125.73,31.75 v125.73,41.91
  Bottom 0.406: v125.73,41.91 127,43.18 CONT.Y
READDATA  (via drill 0.81)
  Top 0.406: U6.7 104.14,20.32 v104.14,21.59 | U3.15 v129.54,25.4
  Bottom 0.406: v104.14,21.59 114.3,21.59 118.11,25.4 v129.54,25.4
RXPC  (via drill 0.81)
  Top 0.406: E11.14 22.86,40.64 22.86,64.77 v21.59,66.04
  Bottom 0.406: v21.59,66.04 19.05,68.58 X4.2
SEC_PLS_H  (via drill 0.81)
  Top 0.406: v129.54,34.29 U3.2
  Bottom 0.406: v129.54,34.29 143.51,34.29 143.51,27.94 CONT.NN
SEC_PLS_L  (via drill 0.81)
  Top 0.406: U3.3 128.27,36.83 v128.27,26.67
  Bottom 0.406: v128.27,26.67 138.43,26.67 CONT.MM
SECPLS  (via drill 0.81)
  Top 0.406: v96.52,38.1 v96.52,22.86
  Bottom 0.406: v96.52,22.86 U6.4 | v96.52,38.1 97.79,39.37 130.81,39.37 U3.1
SECTOR_PULSE
  Bottom 0.406: U6.16 101.6,20.32 100.33,21.59 92.71,21.59 FPGAJ4.15
STATUS  (via drill 0.81)
  Top 0.406: v114.3,16.51 115.57,17.78 115.57,26.67 114.3,27.94 U3.9
  Bottom 0.406: U6.6 100.33,17.78 101.6,16.51 v114.3,16.51
STATUS_CLK_H  (via drill 0.81)
  Top 0.406: U3.6 119.38,33.02 118.11,31.75 v118.11,27.94
  Bottom 0.406: v118.11,27.94 134.62,27.94 138.43,31.75 140.97,31.75 CONT.JJ
STATUS_CLK_L  (via drill 0.81)
  Top 0.406: v121.92,34.29 U3.5
  Bottom 0.406: v121.92,34.29 123.19,33.02 CONT.HH
STATUS_CLOCK
  Bottom 0.406: U6.15 101.6,17.78 100.33,19.05 92.71,19.05 FPGAJ4.13
STATUS_H  (via drill 0.81)
  Top 0.406: U3.10 116.84,35.56 118.11,36.83 v118.11,40.64
  Bottom 0.406: v118.11,40.64 137.16,40.64 138.43,39.37 140.97,39.37 CONT.DD
STATUS_IN
  Bottom 0.406: U6.14 101.6,15.24 100.33,16.51 92.71,16.51 FPGAJ4.11
STATUS_L
  Bottom 0.406: U3.11 119.38,36.83 137.16,36.83 138.43,38.1 CONT.CC
STATUSCLK  (via drill 0.81)
  Top 0.406: v107.95,19.05 109.22,20.32 v109.22,33.02
  Bottom 0.406: U6.5 100.33,20.32 101.6,19.05 v107.95,19.05 | v109.22,33.02 111.76,35.56 114.3,35.56 U3.7
SW_0  (via drill 0.81)
  Top 0.406: S1.1 57.15,57.15 v57.15,76.2 | v119.38,76.2 123.19,72.39 123.19,41.91 120.65,39.37 120.65,24.13 123.19,21.59 v123.19,10.16
  Bottom 0.406: v119.38,76.2 v57.15,76.2 | v123.19,10.16 119.38,6.35 87.63,6.35 87.63,17.78 FPGAJ4.14
SW_1  (via drill 0.81)
  Top 0.406: S1.2 58.42,60.96 59.69,62.23 59.69,90.17 107.95,90.17 107.95,63.5 109.22,62.23 109.22,35.56 107.95,34.29 v107.95,31.75 | v90.17,26.67 90.17,21.59 FPGAJ4.16
  Bottom 0.406: v107.95,31.75 90.17,31.75 v90.17,26.67
SW_2  (via drill 0.81)
  Top 0.406: v92.71,46.99 v92.71,52.07 | v87.63,29.21 87.63,26.67 FPGAJ4.20
  Bottom 0.406: S1.3 62.23,54.61 90.17,54.61 v92.71,52.07 | v92.71,46.99 92.71,44.45 87.63,44.45 v87.63,29.21
SW_3  (via drill 0.81)
  Top 0.406: S1.4 64.77,54.61 80.01,54.61 80.01,62.23 v85.09,67.31 | v135.89,67.31 135.89,10.16 129.54,3.81 93.98,3.81 v93.98,22.86
  Bottom 0.406: v135.89,67.31 v85.09,67.31 | v93.98,22.86 92.71,24.13 87.63,24.13 87.63,27.94 FPGAJ4.22
SW_4  (via drill 0.81)
  Top 0.406: v124.46,66.04 125.73,64.77 125.73,44.45 130.81,39.37 v130.81,11.43 | v92.71,3.81 92.71,29.21 88.9,29.21 FPGAJ4.24
  Bottom 0.406: S1.5 66.04,62.23 64.77,62.23 64.77,66.04 v124.46,66.04 | v130.81,11.43 123.19,3.81 v92.71,3.81
SW_5  (via drill 0.81)
  Top 0.406: v72.39,59.69 S1.6 | v87.63,57.15 90.17,54.61 90.17,36.83 FPGAJ4.28
  Bottom 0.406: v72.39,59.69 83.82,59.69 86.36,57.15 v87.63,57.15
SW_6  (via drill 0.81)
  Top 0.406: v97.79,36.83 v97.79,63.5
  Bottom 0.406: S1.7 71.12,62.23 85.09,62.23 86.36,63.5 v97.79,63.5 | v97.79,36.83 90.17,36.83 FPGAJ4.30
SW_7  (via drill 0.81)
  Top 0.406: v83.82,57.15 87.63,53.34 87.63,41.91 FPGAJ4.32
  Bottom 0.406: S1.8 74.93,57.15 v83.82,57.15
SYS_CLK_H
  Bottom 0.406: U2.10 119.38,55.88 CONT.M
SYS_CLK_L  (via drill 0.81)
  Top 0.406: v114.3,48.26 U2.9 | v143.51,46.99 143.51,54.61 CONT.N
  Bottom 0.406: v114.3,48.26 128.27,48.26 129.54,46.99 v143.51,46.99
SYSCLK
  Bottom 0.406: U5.4 100.33,52.07 118.11,52.07 U2.11
SYSTEM_CLOCK  (via drill 0.81)
  Top 0.406: U5.16 100.33,44.45 v100.33,41.91
  Bottom 0.406: v100.33,41.91 93.98,41.91 92.71,40.64 FPGAJ4.31
TEST_0  (via drill 0.81)
  Top 0.406: FPGAJ1.1 52.07,1.27 24.13,1.27 24.13,6.35 5.08,25.4 v5.08,72.39 | SV1.1 v45.72,86.36
  Bottom 0.406: v5.08,72.39 19.05,86.36 v45.72,86.36
TEST_1  (via drill 0.81)
  Top 0.406: FPGAJ1.3 52.07,3.81 31.75,3.81 31.75,29.21 29.21,31.75 v29.21,41.91 | v48.26,64.77 50.8,67.31 SV1.2
  Bottom 0.406: v29.21,41.91 26.67,41.91 26.67,44.45 21.59,49.53 21.59,58.42 19.05,58.42 17.78,59.69 17.78,64.77 v48.26,64.77
TEST_2
  Top 0.406: FPGAJ1.5 52.07,8.89 52.07,53.34 53.34,54.61 SV1.3
TEST_3  (via drill 0.81)
  Top 0.406: v21.59,11.43 6.35,26.67 6.35,78.74 17.78,90.17 55.88,90.17 SV1.4
  Bottom 0.406: FPGAJ1.7 52.07,11.43 v21.59,11.43
TEST_4  (via drill 0.81)
  Top 0.406: v24.13,13.97 13.97,24.13 13.97,49.53 11.43,52.07 v11.43,81.28
  Bottom 0.406: FPGAJ1.9 52.07,13.97 v24.13,13.97 | v11.43,81.28 17.78,87.63 57.15,87.63 SV1.5
TEST_5  (via drill 0.81)
  Top 0.406: v24.13,16.51 15.24,25.4 15.24,49.53 12.7,52.07 v12.7,68.58 | SV1.6 v60.96,74.93
  Bottom 0.406: FPGAJ1.13 52.07,16.51 v24.13,16.51 | v12.7,68.58 17.78,73.66 22.86,73.66 25.4,71.12 53.34,71.12 57.15,74.93 v60.96,74.93
TEST_6  (via drill 0.81)
  Top 0.406: FPGAJ1.15 54.61,19.05 54.61,6.35 33.02,6.35 33.02,29.21 31.75,30.48 v31.75,46.99 | v59.69,58.42 62.23,60.96 62.23,64.77 64.77,67.31 64.77,87.63 SV1.7
  Bottom 0.406: v31.75,46.99 34.29,49.53 41.91,49.53 43.18,50.8 43.18,55.88 53.34,55.88 55.88,58.42 v59.69,58.42
TEST_7  (via drill 0.81)
  Top 0.406: v33.02,53.34 v33.02,31.75 | v64.77,59.69 67.31,62.23 67.31,87.63 SV1.8
  Bottom 0.406: FPGAJ1.17 54.61,24.13 54.61,31.75 v33.02,31.75 | v33.02,53.34 39.37,59.69 v64.77,59.69
TEST_8
  Bottom 0.406: FPGAJ1.19 52.07,24.13 8.89,24.13 2.54,30.48 2.54,90.17 67.31,90.17 SV1.9
TXPC
  Top 0.406: E11.13 24.13,39.37 24.13,66.04 22.86,67.31 19.05,67.31 X4.3
UART_RXD  (via drill 0.81)
  Top 0.406: E11.12 21.59,31.75 21.59,26.67 16.51,26.67 16.51,49.53 13.97,52.07 13.97,80.01 17.78,83.82 22.86,83.82 v22.86,71.12 | FTDI.4 v104.14,72.39 | FPGAJ4.6 90.17,6.35 90.17,1.27 137.16,1.27 137.16,68.58 135.89,69.85 v135.89,77.47
  Bottom 0.406: v22.86,71.12 24.13,69.85 90.17,69.85 92.71,72.39 v104.14,72.39 | v135.89,77.47 125.73,87.63 105.41,87.63 FTDI.4
UART_TXD  (via drill 0.81)
  Top 0.406: E11.11 19.05,31.75 19.05,49.53 21.59,52.07 21.59,63.5 20.32,64.77 17.78,64.77 17.78,73.66 21.59,77.47 v21.59,82.55 | v96.52,13.97 97.79,15.24 97.79,29.21 102.87,29.21 v102.87,33.02 | v106.68,34.29 107.95,35.56 107.95,62.23 102.87,67.31 102.87,85.09 FTDI.5
  Bottom 0.406: v21.59,82.55 24.13,85.09 46.99,85.09 48.26,86.36 73.66,86.36 74.93,87.63 74.93,90.17 97.79,90.17 FTDI.5 | FPGAJ4.12 90.17,13.97 v96.52,13.97 | v102.87,33.02 104.14,34.29 v106.68,34.29
VCC
  Top 0.406: D37.A D36.A D35.A D34.A D33.A D32.A D31.A D30.A D18.A D28.A D27.A D26.A D25.A D24.A D23.A D22.A D21.A D20.A | C10.1 105.41,31.75 U6.20 | U2.16 133.35,52.07 133.35,31.75 U3.16 U4.1 U4.16 132.08,8.89 121.92,8.89 | C8.1 116.84,13.97 U4.7 | C9.1 121.92,5.08 121.92,8.89 | U4.12 121.92,8.89 | SV1.11 SV1.12 76.2,68.58 | 110.49,55.88 C6.1 | 110.49,55.88 110.49,71.12 C11.1 | D17.A D16.A | 69.85,68.58 D13.A 76.2,68.58 | 69.85,68.58 D12.A | 76.2,68.58 D14.A | FPGAJ1.29 54.61,39.37 54.61,53.34 55.88,54.61 62.23,54.61 62.23,57.15 63.5,58.42 69.85,58.42 69.85,68.58 | C7.1 110.49,33.02 110.49,55.88 | R3.2 139.7,78.74 R5.2
  Bottom 0.406: D28.A E11.16 | C2.1 8.89,34.29 24.13,34.29 D26.A | 110.49,30.48 C7.1 | U6.20 110.49,30.48 | 123.19,29.21 U3.12 | 123.19,29.21 130.81,29.21 U3.16 | 110.49,30.48 111.76,29.21 123.19,29.21 | C8.1 120.65,13.97 U4.12 | FPGAJ4.2 FPGAJ4.1 124.46,2.54 132.08,10.16 U4.16 | U1.4 118.11,85.09 96.52,85.09 92.71,88.9 SV1.12 | U5.1 U5.20 107.95,62.23 123.19,62.23 U2.4 120.65,57.15 118.11,57.15 115.57,54.61 C6.1 | 130.81,72.39 U1.16 | 130.81,72.39 C11.1 109.22,69.85 95.25,69.85 D17.A | D14.A D15.A D16.A | D12.A D11.A D10.A 57.15,67.31 26.67,67.31 D33.A | R5.2 138.43,72.39 130.81,72.39
WR_DATA_H  (via drill 0.81)
  Top 0.406: U2.1 134.62,58.42 v134.62,53.34
  Bottom 0.406: v134.62,53.34 137.16,50.8 CONT.S
WR_DATA_L  (via drill 0.81)
  Top 0.406: U2.2 130.81,59.69 v130.81,52.07
  Bottom 0.406: v130.81,52.07 133.35,49.53 140.97,49.53 CONT.T
WR_GATE_H
  Top 0.406: R3.1 143.51,69.85 143.51,62.23 139.7,62.23 CONT.H
  Bottom 0.406: U2.15 130.81,54.61 143.51,54.61 143.51,62.23 140.97,62.23 CONT.H
WR_GATE_L  (via drill 0.81)
  Top 0.406: v127,57.15 U2.14 | R5.1 R4.2 130.81,81.28 v130.81,62.23
  Bottom 0.406: v127,57.15 129.54,59.69 130.81,59.69 | 130.81,59.69 140.97,59.69 CONT.J | 130.81,59.69 v130.81,62.23
WRDATA  (via drill 0.81)
  Top 0.406: U5.3 100.33,57.15 v100.33,63.5
  Bottom 0.406: v100.33,63.5 124.46,63.5 U2.3
WRGATE
  Bottom 0.406: U5.5 100.33,49.53 120.65,49.53 U2.13
WRITE_DATA  (via drill 0.81)
  Top 0.406: U5.17 102.87,57.15 v102.87,62.23 | v87.63,62.23 86.36,60.96 86.36,55.88 v88.9,53.34
  Bottom 0.406: v87.63,62.23 v102.87,62.23 | v88.9,53.34 87.63,52.07 87.63,46.99 90.17,46.99 FPGAJ4.35
WRITE_GATE
  Bottom 0.406: U5.15 104.14,48.26 102.87,46.99 96.52,46.99 92.71,43.18 92.71,41.91 90.17,41.91 90.17,38.1 FPGAJ4.29
XLED_0
  Top 0.406: FPGAJ1.2 R23.2
XLED_1
  Bottom 0.406: R24.2 43.18,5.08 FPGAJ1.4
XLED_2
  Top 0.406: R25.2 44.45,12.7 49.53,7.62 FPGAJ1.6
XLED_3
  Top 0.406: R26.2 48.26,10.16 FPGAJ1.8
XLED_4
  Top 0.406: R27.2 41.91,21.59 41.91,19.05 48.26,12.7 FPGAJ1.10
XLED_5  (via drill 0.81)
  Top 0.406: R28.2 43.18,25.4 v43.18,20.32
  Bottom 0.406: v43.18,20.32 45.72,17.78 FPGAJ1.14
XLED_6  (via drill 0.81)
  Top 0.406: R29.2 43.18,30.48 43.18,26.67 44.45,25.4 v44.45,21.59
  Bottom 0.406: v44.45,21.59 45.72,20.32 FPGAJ1.16
XLED_7  (via drill 0.81)
  Top 0.406: v43.18,38.1 45.72,35.56 v45.72,22.86
  Bottom 0.406: v43.18,38.1 R30.2 | FPGAJ1.18 v45.72,22.86
XLED_8  (via drill 0.81)
  Top 0.406: v45.72,43.18 46.99,41.91 v46.99,25.4
  Bottom 0.406: v45.72,43.18 R31.2 | FPGAJ1.20 v46.99,25.4
XLED_9  (via drill 0.81)
  Top 0.406: R21.2 40.64,45.72 39.37,44.45 v39.37,26.67
  Bottom 0.406: v39.37,26.67 44.45,26.67 45.72,27.94 FPGAJ1.22
XLED_10  (via drill 0.81)
  Top 0.406: R12.2 40.64,50.8 41.91,49.53 41.91,33.02 v44.45,30.48
  Bottom 0.406: FPGAJ1.24 v44.45,30.48
XLED_11  (via drill 0.81)
  Top 0.406: v49.53,57.15 49.53,34.29 FPGAJ1.26
  Bottom 0.406: R22.2 41.91,57.15 v49.53,57.15
XLED_12  (via drill 0.81)
  Top 0.406: R32.2 40.64,60.96 39.37,59.69 39.37,45.72 38.1,44.45 v38.1,35.56
  Bottom 0.406: FPGAJ1.28 v38.1,35.56
XLED_13  (via drill 0.81)
  Top 0.406: v43.18,68.58 43.18,43.18 v45.72,40.64
  Bottom 0.406: v43.18,68.58 R33.2 | FPGAJ1.32 v45.72,40.64
XLED_14  (via drill 0.81)
  Top 0.406: R34.2 41.91,72.39 v41.91,52.07
  Bottom 0.406: v41.91,52.07 40.64,50.8 27.94,50.8 26.67,49.53 26.67,45.72 39.37,45.72 40.64,44.45 49.53,44.45 FPGAJ1.34
XLED_15  (via drill 0.81)
  Top 0.406: R35.2 39.37,77.47 39.37,60.96 38.1,59.69 v38.1,48.26
  Bottom 0.406: v38.1,48.26 40.64,45.72 FPGAJ1.36
XLED_16  (via drill 0.81)
  Top 0.406: R36.2 44.45,80.01 v44.45,52.07
  Bottom 0.406: v44.45,52.07 48.26,48.26 FPGAJ1.38
XLED_17  (via drill 0.81)
  Top 0.406: v45.72,83.82 R37.2 | v52.07,83.82 52.07,54.61 50.8,53.34 FPGAJ1.40
  Bottom 0.406: v52.07,83.82 v45.72,83.82